# EAGLE design pico-glitcher-v1 (EAGLE 9.7.0)
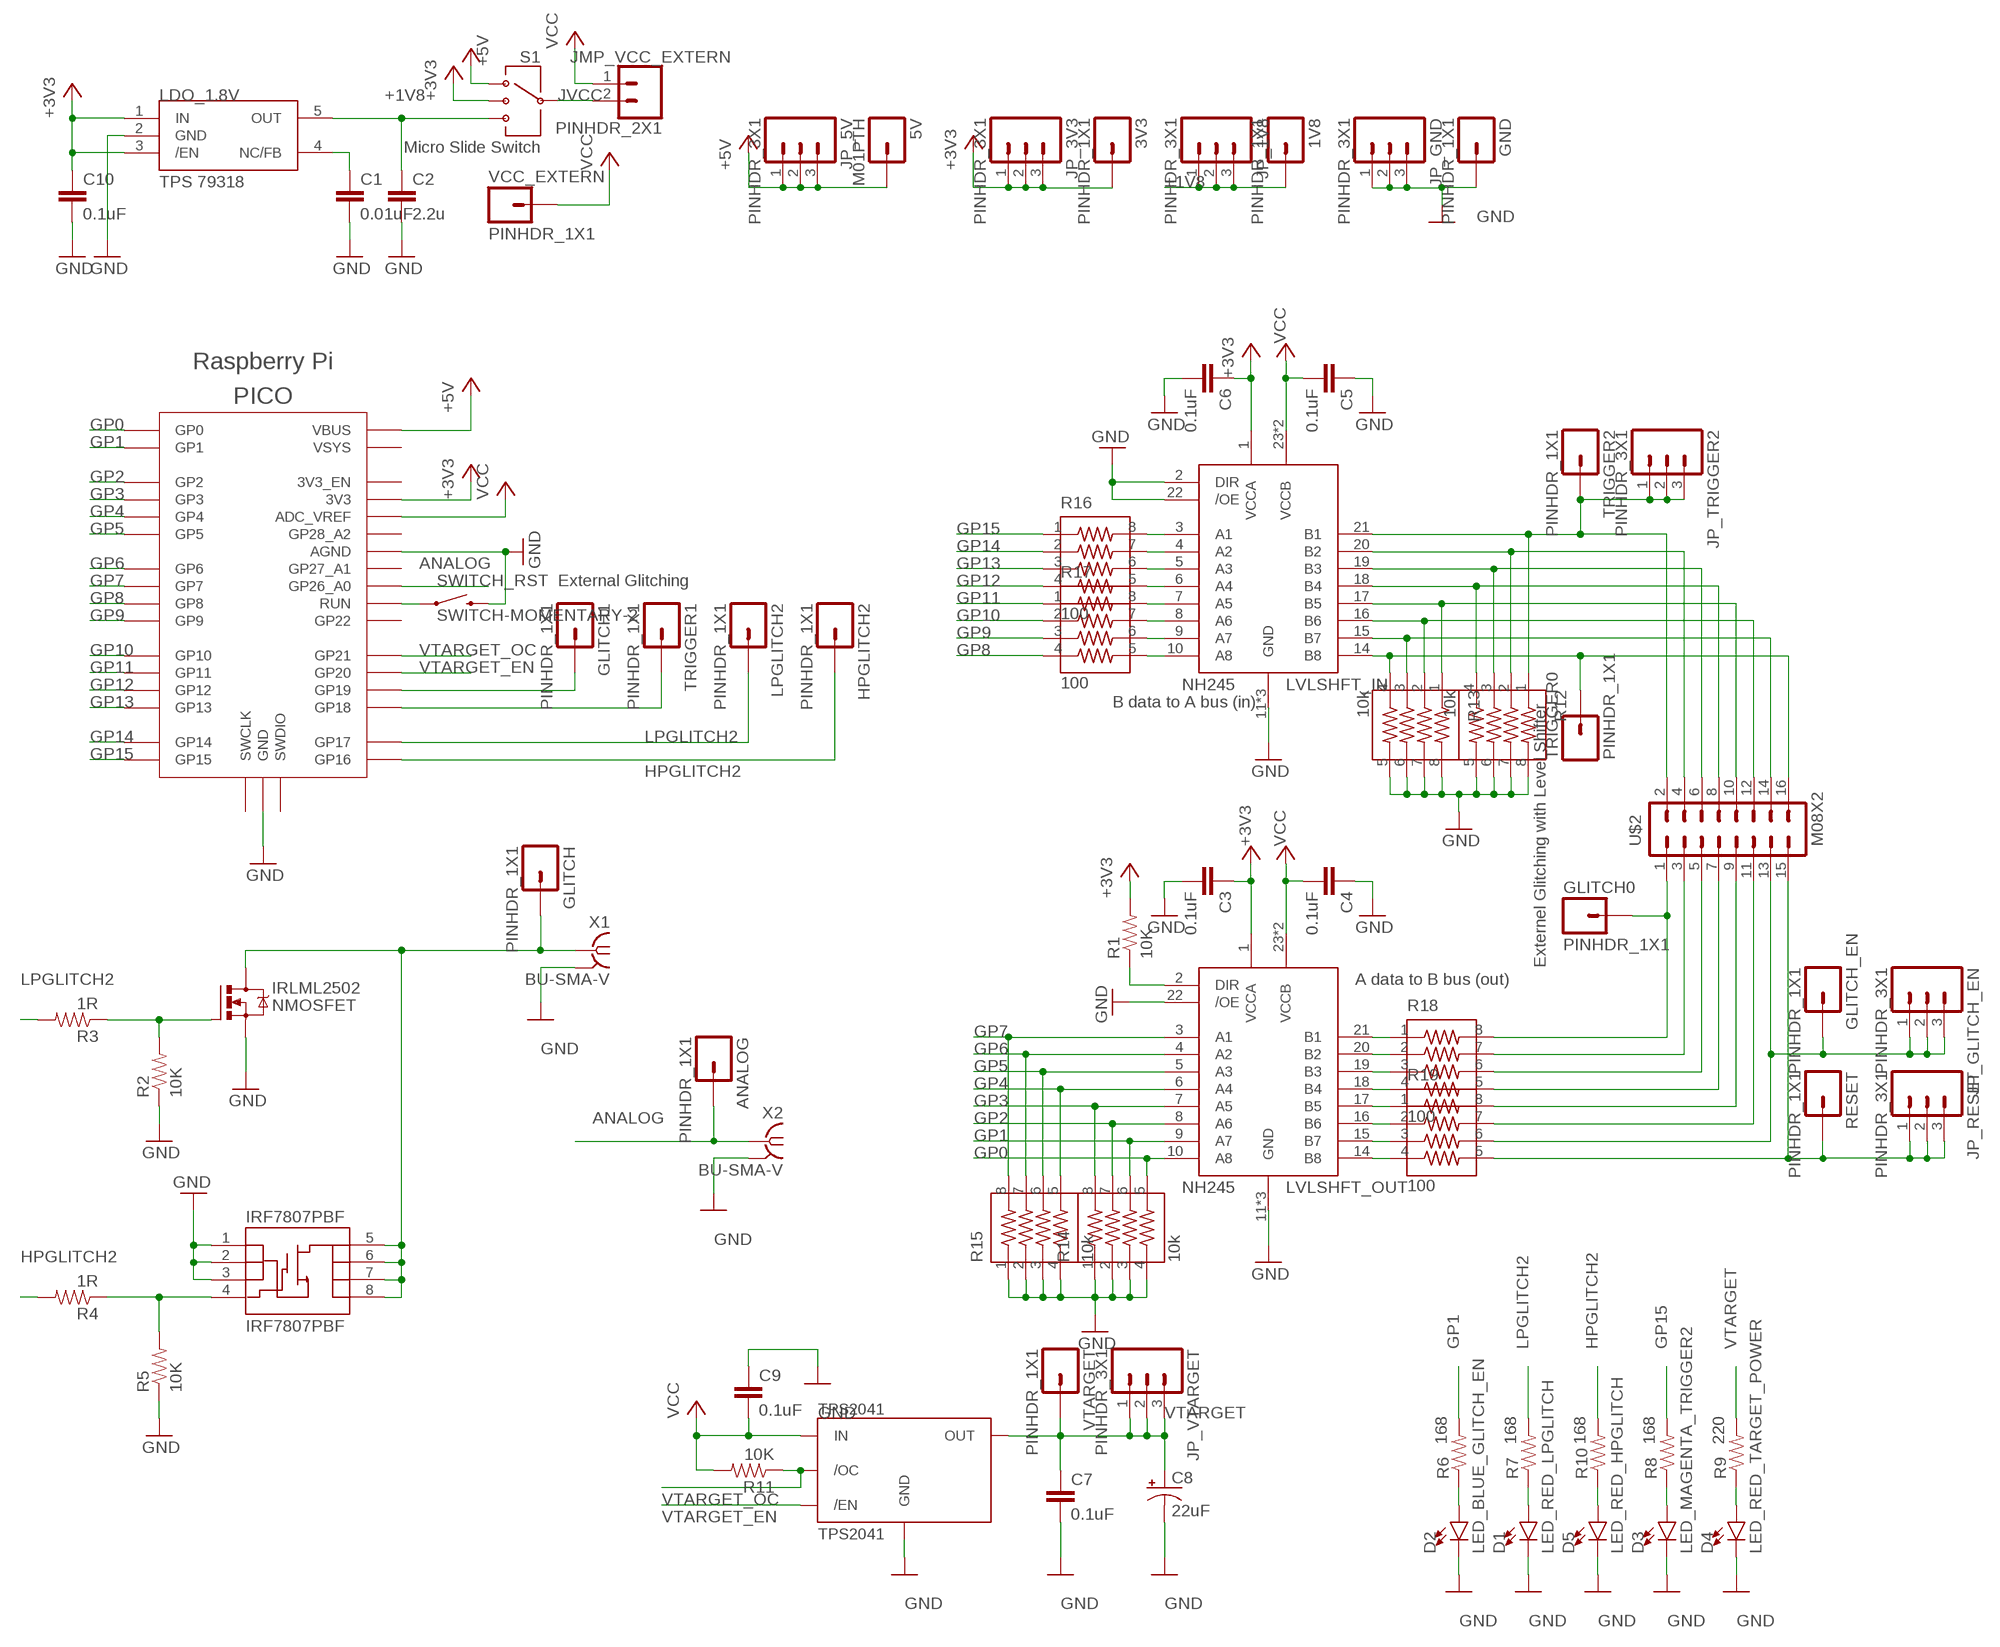
[diagram p0: schematic, sheet 1]

## Parts
1V8  PINHDR_1X1  M01PTH  [1X01]
3V3  PINHDR_1X1  M01PTH  [1X01]
5V  M01PTH  [1X01]
ANALOG  PINHDR_1X1  M01PTH  [1X01]
C1  0.01uF  0.1UF-0603-25V-10%-X7R-WE  [0603]
C2  2.2u  CAP-0805  [0805]
C3  0.1uF  0.1UF-0603-25V-10%-X7R-WE  [0603]
C4  0.1uF  0.1UF-0603-25V-10%-X7R-WE  [0603]
C5  0.1uF  0.1UF-0603-25V-10%-X7R-WE  [0603]
C6  0.1uF  0.1UF-0603-25V-10%-X7R-WE  [0603]
C7  0.1uF  0.1UF-0603-25V-10%-X7R-WE  [0603]
C8  22uF  22UF-POLAR-PANASONIC_C-35V-20%  [PANASONIC_C]
C9  0.1uF  0.1UF-0603-25V-10%-X7R-WE  [0603]
C10  0.1uF  0.1UF-0603-25V-10%-X7R-WE  [0603]
D1  LED_RED_LPGLITCH  LED0603  [LED-0603]
D2  LED_BLUE_GLITCH_EN  LED0603  [LED-0603]
D3  LED_MAGENTA_TRIGGER2  LED0603  [LED-0603]
D4  LED_RED_TARGET_POWER  LED0603  [LED-0603]
D5  LED_RED_HPGLITCH  LED0603  [LED-0603]
GLITCH  PINHDR_1X1  M01PTH  [1X01]
GLITCH0  PINHDR_1X1  M01PTH  [1X01]
GLITCH1  PINHDR_1X1  M01PTH  [1X01]
GLITCH_EN  PINHDR_1X1  M01PTH  [1X01]
GND  PINHDR_1X1  M01PTH  [1X01]
HPGLITCH2  PINHDR_1X1  M01PTH  [1X01]
IRF7807PBF  IRF7807PBF  MOSFET-NCHANNEL-SOIC8  [SO08]
IRLML2502  NMOSFET  NMOSFETSOT23-GSD  [SOT23]
JP_1V8  PINHDR_3X1  M03PTH  [1X03]
JP_3V3  PINHDR_3X1  M03PTH  [1X03]
JP_5V  PINHDR_3X1  M03PTH  [1X03]
JP_GLITCH_EN  PINHDR_3X1  M03PTH  [1X03]
JP_GND  PINHDR_3X1  M03PTH  [1X03]
JP_RESET  PINHDR_3X1  M03PTH  [1X03]
JP_TRIGGER2  PINHDR_3X1  M03PTH  [1X03]
JP_VTARGET  PINHDR_3X1  M03PTH  [1X03]
LDO_1.8V  TPS 79318  TPS769XX  [SOT23-5L]
LPGLITCH2  PINHDR_1X1  M01PTH  [1X01]
LVLSHFT_IN  NH245  NH245-SN74LVC8T245  [TSSOP24]
LVLSHFT_OUT  NH245  NH245-SN74LVC8T245  [TSSOP24]
PICO  Raspberry Pi  RPI_PICO-SMD  [RPI_PICO]
PINHDR_2X1  JMP_VCC_EXTERN  CONN_02  [1X02]
R1  10K  10KOHM1/10W1%(0603)0603  [0603-RES]
R2  10K  10KOHM1/10W1%(0603)0603  [0603-RES]
R3  1R  10KOHM1/10W1%(0603)0603  [0603-RES]
R4  1R  10KOHM1/10W1%(0603)0603  [0603-RES]
R5  10K  10KOHM1/10W1%(0603)0603  [0603-RES]
R6  168  10KOHM1/10W1%(0603)0603  [0603-RES]
R7  168  10KOHM1/10W1%(0603)0603  [0603-RES]
R8  168  10KOHM1/10W1%(0603)0603  [0603-RES]
R9  220  10KOHM1/10W1%(0603)0603  [0603-RES]
R10  168  10KOHM1/10W1%(0603)0603  [0603-RES]
R11  10K  10KOHM1/10W1%(0603)0603  [0603-RES]
R12  10k  742C083103JP  [742C083103JP]
R13  10k  742C083103JP  [742C083103JP]
R14  10k  742C083103JP  [742C083103JP]
R15  10k  742C083103JP  [742C083103JP]
R16  100  742C083103JP  [742C083103JP]
R17  100  742C083103JP  [742C083103JP]
R18  100  742C083103JP  [742C083103JP]
R19  100  742C083103JP  [742C083103JP]
RESET  PINHDR_1X1  M01PTH  [1X01]
S1  Micro Slide Switch  SWITCH-SP3T  [SWITCH-SP3T-SMD]
SWITCH_RST  SWITCH-MOMENTARY-2  [TACTILE_SWITCH_TALL]
TPS2041  TPS2041  [SO08]
TRIGGER0  PINHDR_1X1  M01PTH  [1X01]
TRIGGER1  PINHDR_1X1  M01PTH  [1X01]
TRIGGER2  PINHDR_1X1  M01PTH  [1X01]
U$2  M08X2  [2X8]
VCC_EXTERN  PINHDR_1X1  M01PTH  [1X01]
VTARGET  PINHDR_1X1  M01PTH  [1X01]
X1  BU-SMA-V  [BU-SMA-V]
X2  BU-SMA-V  [BU-SMA-V]

## Nets
+1V8: 1V8.1 C2.1 JP_1V8.1 JP_1V8.2 JP_1V8.3 LDO_1.8V.5(OUT) S1.4
+3V3: 3V3.1 C3.1 C6.1 C10.1 JP_3V3.1 JP_3V3.2 JP_3V3.3 LDO_1.8V.1(IN) LDO_1.8V.3(/EN) LVLSHFT_IN.1(VCCA) LVLSHFT_OUT.1(VCCA) PICO.3V3 R1.2 S1.2
+5V: 5V.1 JP_5V.1 JP_5V.2 JP_5V.3 PICO.VBUS S1.1
ANALOG: ANALOG.1 PICO.GP26_A0 X2.1
GLITCH: GLITCH.1 IRF7807PBF.5(D) IRF7807PBF.6(D) IRF7807PBF.7(D) IRF7807PBF.8(D) IRLML2502.3(D) X1.1
GND: C1.2 C2.2 C3.2 C4.1 C5.1 C6.2 C7.2 C8.- C9.1 C10.2 D1.C D2.C D3.C D4.C D5.C GND.1 IRF7807PBF.1(S) IRF7807PBF.2(S) IRF7807PBF.3(S) IRLML2502.2(S) JP_GND.1 JP_GND.2 JP_GND.3 LDO_1.8V.2(GND) LVLSHFT_IN.2(DIR) LVLSHFT_IN.11(GND) LVLSHFT_IN.12(GND) LVLSHFT_IN.13(GND) LVLSHFT_IN.22(/OE) LVLSHFT_OUT.11(GND) LVLSHFT_OUT.12(GND) LVLSHFT_OUT.13(GND) LVLSHFT_OUT.22(/OE) PICO.AGND PICO.GND@1(GND) PICO.GND@2(GND) PICO.GND@3(GND) PICO.GND@4(GND) PICO.GND@5(GND) PICO.GND@6(GND) PICO.GND@7(GND) PICO.GND@8(GND) R2.1 R5.1 R12.5 R12.6 R12.7 R12.8 R13.5 R13.6 R13.7 R13.8 R14.1 R14.2 R14.3 R14.4 R15.1 R15.2 R15.3 R15.4 SWITCH_RST.B2 TPS2041.1(GND) X1.2 X1.3 X1.4 X1.5 X2.2 X2.3 X2.4 X2.5
GP0: LVLSHFT_OUT.10(A8) PICO.GP0 R14.5
GP1: LVLSHFT_OUT.9(A7) PICO.GP1 R6.2 R14.6
GP2: LVLSHFT_OUT.8(A6) PICO.GP2 R14.7
GP3: LVLSHFT_OUT.7(A5) PICO.GP3 R14.8
GP4: LVLSHFT_OUT.6(A4) PICO.GP4 R15.5
GP5: LVLSHFT_OUT.5(A3) PICO.GP5 R15.6
GP6: LVLSHFT_OUT.4(A2) PICO.GP6 R15.7
GP7: LVLSHFT_OUT.3(A1) PICO.GP7 R15.8
GP8: PICO.GP8 R17.4
GP9: PICO.GP9 R17.3
GP10: PICO.GP10 R17.2
GP11: PICO.GP11 R17.1
GP12: PICO.GP12 R16.4
GP13: PICO.GP13 R16.3
GP14: PICO.GP14 R16.2
GP15: PICO.GP15 R8.2 R16.1
HPGLITCH2: HPGLITCH2.1 PICO.GP16 R4.2 R10.2
JVCC: PINHDR_2X1.2 S1.3
LPGLITCH2: LPGLITCH2.1 PICO.GP17 R3.2 R7.2
N$1: D3.A R8.1
N$2: D1.A R7.1
N$3: IRLML2502.1(G) R2.2 R3.1
N$4: D2.A R6.1
N$5: IRF7807PBF.4(G) R4.1 R5.2
N$6: D4.A R9.1
N$7: D5.A R10.1
N$8: C1.1 LDO_1.8V.4(NC/FB)
N$9: LVLSHFT_OUT.21(B1) R18.1
N$10: LVLSHFT_OUT.20(B2) R18.2
N$11: LVLSHFT_OUT.19(B3) R18.3
N$12: LVLSHFT_OUT.18(B4) R18.4
N$13: LVLSHFT_OUT.17(B5) R19.1
N$14: LVLSHFT_OUT.16(B6) R19.2
N$15: LVLSHFT_OUT.15(B7) R19.3
N$16: LVLSHFT_OUT.14(B8) R19.4
N$17: LVLSHFT_IN.3(A1) R16.8
N$18: LVLSHFT_IN.4(A2) R16.7
N$19: LVLSHFT_IN.5(A3) R16.6
N$20: LVLSHFT_IN.6(A4) R16.5
N$21: LVLSHFT_IN.7(A5) R17.8
N$22: LVLSHFT_IN.8(A6) R17.7
N$23: LVLSHFT_IN.9(A7) R17.6
N$24: LVLSHFT_IN.10(A8) R17.5
N$26: JP_TRIGGER2.1 JP_TRIGGER2.2 JP_TRIGGER2.3 LVLSHFT_IN.21(B1) R12.1 TRIGGER2.1 U$2.2
N$33: LVLSHFT_OUT.2(DIR) R1.1
N$34: PICO.RUN SWITCH_RST.A2
N$37: GLITCH1.1 PICO.GP19
N$38: JP_RESET.1 JP_RESET.2 JP_RESET.3 R19.5 RESET.1 U$2.15
N$39: GLITCH_EN.1 JP_GLITCH_EN.1 JP_GLITCH_EN.2 JP_GLITCH_EN.3 R19.6 U$2.13
N$40: R19.7 U$2.11
N$41: R19.8 U$2.9
N$42: R18.5 U$2.7
N$43: R18.6 U$2.5
N$44: R18.7 U$2.3
N$45: GLITCH0.1 R18.8 U$2.1
N$47: LVLSHFT_IN.20(B2) R12.2 U$2.4
N$48: LVLSHFT_IN.19(B3) R12.3 U$2.6
N$49: LVLSHFT_IN.18(B4) R12.4 U$2.8
N$50: LVLSHFT_IN.17(B5) R13.1 U$2.10
N$51: LVLSHFT_IN.16(B6) R13.2 U$2.12
N$52: LVLSHFT_IN.15(B7) R13.3 U$2.14
N$53: LVLSHFT_IN.14(B8) R13.4 TRIGGER0.1 U$2.16
N$54: PICO.GP18 TRIGGER1.1
VCC: C4.2 C5.2 C9.2 LVLSHFT_IN.23(VCCB) LVLSHFT_IN.24(VCCB) LVLSHFT_OUT.23(VCCB) LVLSHFT_OUT.24(VCCB) PICO.ADC_VREF PINHDR_2X1.1 R11.2 TPS2041.2(IN) TPS2041.3(IN) VCC_EXTERN.1
VTARGET: C7.1 C8.+ JP_VTARGET.1 JP_VTARGET.2 JP_VTARGET.3 R9.2 TPS2041.6(OUT) TPS2041.7(OUT) TPS2041.8(OUT) VTARGET.1
VTARGET_EN: PICO.GP20 TPS2041.4(/EN)
VTARGET_OC: PICO.GP21 R11.1 TPS2041.5(/OC)
Unconnected: PICO.3V3_EN PICO.GP22 PICO.GP27_A1 PICO.GP28_A2 PICO.SWCLK PICO.SWDIO PICO.VSYS

## Notes on the sheet
- External Glitching
- B data to A bus (in)
- Externel Glitching with Level Shifter
- A data to B bus (out)

## Library data of the parts
1V8 3V3 5V ANALOG GLITCH GLITCH0 GLITCH1 GLITCH_EN GND HPGLITCH2 LPGLITCH2 RESET TRIGGER0 TRIGGER1 TRIGGER2 VCC_EXTERN VTARGET = SparkFun-Connectors:M01: Header 1 Standard 1-pin 0.1" header. Use with straight break away headers (SKU : PRT-00116), right angle break away headers (PRT-00553), swiss pins (PRT-00743), machine pins (PRT-00117), and female headers (PRT-00115).
C1 = SparkFun-Capacitors:0.1UF: 0.1µF ceramic capacitors A capacitor is a passive two-terminal electrical component used to store electrical energy temporarily in an electric field.; PROD_ID: CAP-16503; VALUE: 0.1uF
C2 = SparkFun-Capacitors:CAP
C3-C7 C9 C10 = SparkFun-Capacitors:0.1UF: 0.1µF ceramic capacitors A capacitor is a passive two-terminal electrical component used to store electrical energy temporarily in an electric field.; PROD_ID: CAP-16503
C8 = SparkFun-Capacitors:22UF-POLAR: 22µF polarized capacitors A capacitor is a passive two-terminal electrical component used to store electrical energy temporarily in an electric field.; PROD_ID: CAP-08618
D1-D5 = SparkFun-LED:LED: LED (Generic) Standard schematic elements and footprints for 5mm, 3mm, 1206, and 0603 sized LEDs. Generic LEDs with no color specified.
IRF7807PBF = SparkFun:MOSFET-NCHANNEL-SOIC8: N-Channel MOSFET IRF9410 and NDS8434 are common, SOIC-8 parts.
IRLML2502 = Transistor:NMOSFET: N-Channel MOSFET - Generic; CATEGORY: Transistor; SUB-CATEGORY: MOSFET; TYPE: N-Channel
JP_1V8 JP_3V3 JP_5V JP_GLITCH_EN JP_GND JP_RESET JP_TRIGGER2 JP_VTARGET = SparkFun-Connectors:M03: Header 3 Standard 3-pin 0.1" header. Use with straight break away headers (SKU : PRT-00116), right angle break away headers (PRT-00553), swiss pins (PRT-00743), machine pins (PRT-00117), and female headers (PRT-00115). Molex polarized connector foot print use with SKU : PRT-08232 with associated crimp pins and housings.
LDO_1.8V = tps769xx:TPS769XX
LVLSHFT_IN LVLSHFT_OUT = TI_NH245_SN74LVC8T245:NH245-SN74LVC8T245
PICO = RaspberryPi_Pico:RPI_PICO
PINHDR_2X1 = SparkFun-Connectors:CONN_02: Multi connection point. Often used as Generic Header-pin footprint for 0.1 inch spaced/style header connections On any of the 0.1 inch spaced packages, you can populate with these: Break Away Headers - Straight <https://www.sparkfun.com/products/116> (PRT-00116) Break Away Male Headers - Right Angle <https://www.sparkfun.com/products/553> (PRT-00553) Female Headers <https://www.sparkfun.com/products/115> (PRT-00115) Break Away Headers - Machine Pin <https://www.sparkfun.com/products/117> (PRT-00117) Break Away Female Headers - Swiss Machine Pin <https://www.sparkfun.com/products/743> (PRT-00743) For SCREWTERMINALS and SPRING TERMINALS visit here: Screw Terimnals on SparkFun.com <https://www.sparkfun.com/search/results?term=Screw+Terminals> (5mm/3.5mm/2.54mm spacing) This device is also useful as a general connection point to wire up your design to another part of your project. Our various solder wires solder well into these plated through hole pads. Hook-Up Wire - Assortment (Stranded, 22 AWG) <https://www.sparkfun.com/products/11375> (PRT-11375) Hook-Up Wire - Assortment (Solid Core, 22 AWG) <https://www.sparkfun.com/products/11367> (PRT-11367) View the entire wire category on our website here <https://www.sparkfun.com/categories/141> Special notes: Molex polarized connector foot print use with: PRT-08233 with associated crimp pins and housings. 2.54_SCREWTERM for use with PRT-10571. 3.5mm Screw Terminal footprints for PRT-08084 5mm Screw Terminal footprints for use with PRT-08432
R1 R2 R5 R11 = SparkFun-Resistors:10KOHM1/10W1%(0603): RES-00824; PROD_ID: RES-00824
R3 R4 R6-R10 = SparkFun-Resistors:10KOHM1/10W1%(0603): RES-00824; PROD_ID: RES-00824; VALUE: 10K
R12-R19 = Resistor Array:742C083103JP: RES ARRAY 4 RES 10K OHM 1206 Manufacturer's datasheet <https://www.ctscorp.com/wp-content/uploads/74x.pdf>; CREATED_BY: PCBLayout.com; DIGIKEY_PN: 742C083103JPTR-ND; MANUFACTURER: CTS Resistor Products; MPN: 742C083103JP; PACKAGE: 1206
S1 = SparkFun:SWITCH-SP3T
SWITCH_RST = SparkFun:SWITCH-MOMENTARY-2
TPS2041 = TPS2041:TPS2041
U$2 = SparkFun-Connectors:M08X2: .1" headers, two rows of 8 each
X1 X2 = con-coax:BU-SMA-V: FEMALE SMA CONNECTOR Radiall distributor RS 112-3794; OC_FARNELL: unknown; OC_NEWARK: unknown

## Board
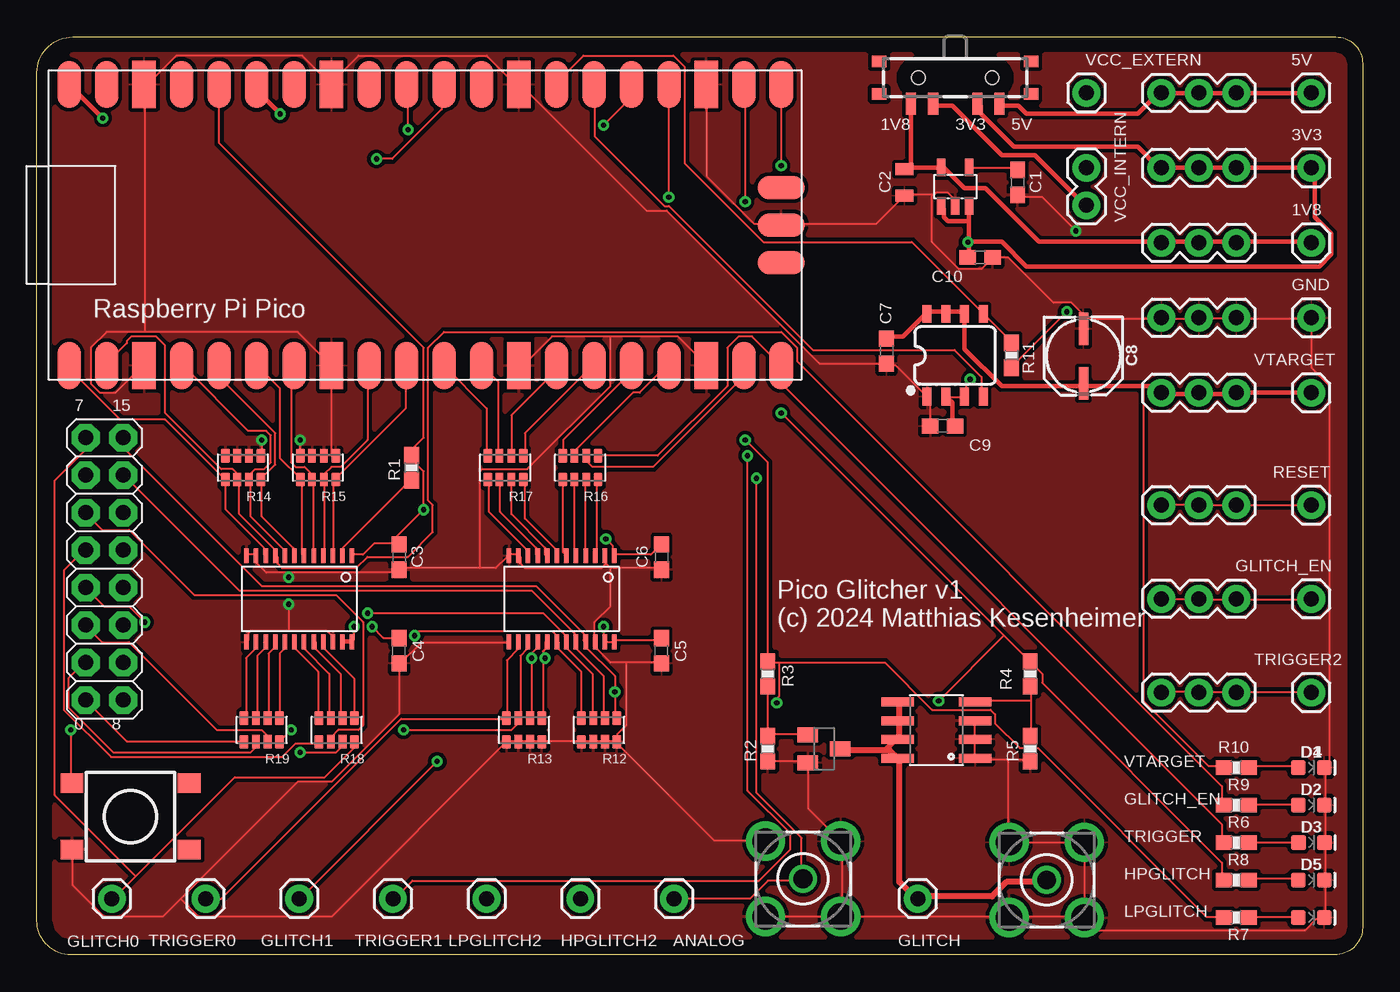
[diagram p1: board, top side]
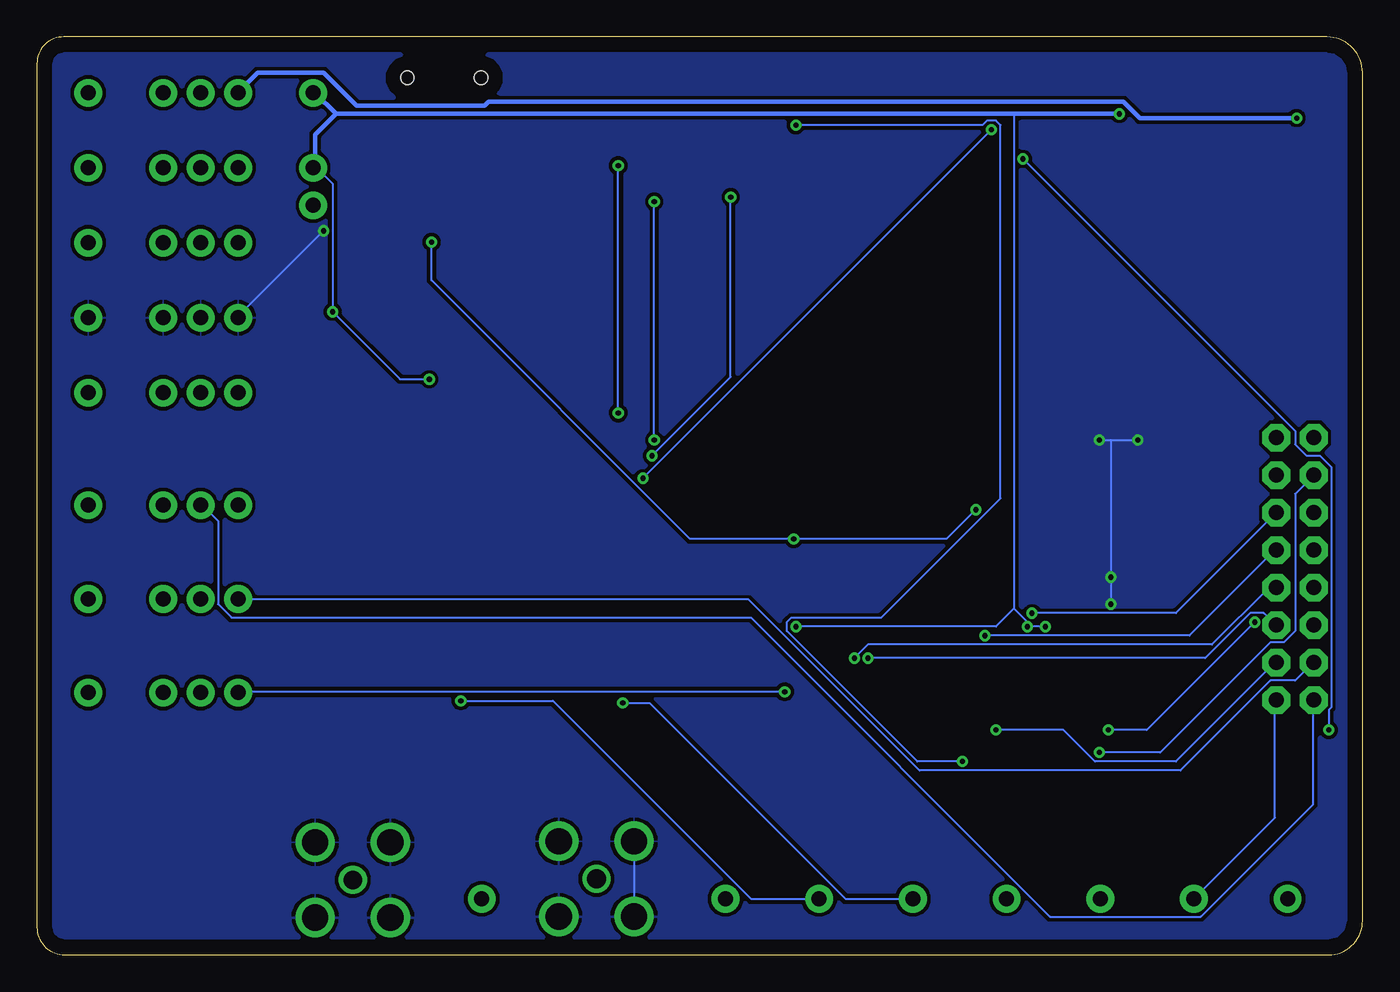
[diagram p2: board, bottom side, seen from below]

Size 89.84 x 62.22 mm. Coordinates in mm from the lower left corner, seen from the top.
Outline: 0,59.79 arc-90 2.43,62.22 88.04,62.22 arc-90 89.84,60.42 89.84,1.89 arc-90 87.95,0 2.32,0 arc-90 0,2.32 0,59.79
Copper layers (1*16): Top / Bottom
Stack-up Default Layer Stack: Top User Defined 0.035mm / Dielectric-1 User Defined 1.5mm / Bottom User Defined 0.035mm
Design rules: minimum drill size 0.35mm, minimum copper width 6mil, keepout clearance 0mil, drill distance 6mil, via restrict clearance 0mil, dimension clearance 40mil, restrict clearance 0mil, copper clearance wire_polygon to wire_polygon 6mil, copper clearance wire_polygon to pad_smd 6mil, copper clearance wire_polygon to via 6mil, copper clearance pad_smd to pad_smd 6mil, copper clearance pad_smd to via 6mil, copper clearance via to via 6mil, copper clearance smd to pad (same net) 6mil, copper clearance smd to via (same net) 6mil, copper clearance smd to smd (same net) 6mil

### Footprints (pad centres in the part's own frame; a part is rotated, then mirrored left to right if it is on the bottom)
1X01 = drill 1.016 pad 1.88: 1 0,0
0603 = smd 1.1 x 1: 1 -0.85,0; 2 0.85,0
0805 = smd 0.8 x 1.2: 1 -0.9,0; 2 0.9,0
PANASONIC_C = smd 2.2 x 0.65: + 1.9,-0.2; - -1.8,-0.2
LED-0603 = smd 1 x 1: A -0.877,0; C 0.877,0
SO08 = smd 0.61 x 2.21: 1 -1.905,-2.616; 2 -0.635,-2.616; 3 0.635,-2.616; 4 1.905,-2.616; 5 1.905,2.616; 6 0.635,2.616; 7 -0.635,2.616; 8 -1.905,2.616
SOT23 = smd 1 x 1.4: 1 -0.95,-1.1; 2 0.95,-1.1; 3 0,1.1
1X03 = drill 1.016 pad 1.88: 1 0,0; 2 2.54,0; 3 5.08,0
SOT23-5L = smd 0.55 x 1.2: 1 -0.95,-1.3; 2 0,-1.3; 3 0.95,-1.3; 4 0.95,1.3; 5 -0.95,1.3
TSSOP24 = smd 0.305 x 0.991: 1 -3.575,-2.918; 2 -2.925,-2.918; 3 -2.275,-2.918; 4 -1.625,-2.918; 5 -0.975,-2.918; 6 -0.325,-2.918; 7 0.325,-2.918; 8 0.975,-2.918; 9 1.625,-2.918; 10 2.275,-2.918; 11 2.925,-2.918; 12 3.575,-2.918; 13 3.575,2.918; 14 2.925,2.918; 15 2.275,2.918; 16 1.625,2.918; 17 0.975,2.918; 18 0.325,2.918; 19 -0.325,2.918; 20 -0.975,2.918; 21 -1.625,2.918; 22 -2.275,2.918; 23 -2.925,2.918; 24 -3.575,2.918
RPI_PICO = smd 3.2 x 1.6: 3V3 9.525,13.97; 3V3_EN 9.525,16.51; ADC_VREF 9.525,11.43; AGND 9.525,6.35; GND@1 -9.525,19.05; GND@2 -9.525,6.35; GND@3 -9.525,-6.35; GND@4 -9.525,-19.05; GND@6 9.525,-19.05; GND@7 9.525,-6.35; GND@8 9.525,19.05; GP0 -9.525,24.13; GP1 -9.525,21.59; GP2 -9.525,16.51; GP3 -9.525,13.97; GP4 -9.525,11.43; GP5 -9.525,8.89; GP6 -9.525,3.81; GP7 -9.525,1.27; GP8 -9.525,-1.27; GP9 -9.525,-3.81; GP10 -9.525,-8.89; GP11 -9.525,-11.43; GP12 -9.525,-13.97; GP13 -9.525,-16.51; GP14 -9.525,-21.59; GP15 -9.525,-24.13; GP16 9.525,-24.13; GP17 9.525,-21.59; GP18 9.525,-16.51; GP19 9.525,-13.97; GP20 9.525,-11.43; GP21 9.525,-8.89; GP22 9.525,-3.81; GP26_A0 9.525,1.27; GP27_A1 9.525,3.81; GP28_A2 9.525,8.89; RUN 9.525,-1.27; VBUS 9.525,24.13; VSYS 9.525,21.59 | smd 1.6 x 3.2: GND@5 0,-24.13; SWCLK -2.54,-24.13; SWDIO 2.54,-24.13
1X02 = drill 1.016 pad 1.88: 1 0,0; 2 2.54,0
0603-RES = smd 1.1 x 1: 1 -0.85,0; 2 0.85,0
742C083103JP = smd 0.59 x 0.92: 1 -1.2,-0.8; 2 -0.4,-0.8; 3 0.4,-0.8; 4 1.2,-0.8; 5 1.2,0.8; 6 0.4,0.8; 7 -0.4,0.8; 8 -1.2,0.8
SWITCH-SP3T-SMD = smd 0.7 x 1.5: 1 3,-1.75; 2 1.5,-1.75; 3 -1.5,-1.75; 4 -3,-1.75 | smd 1 x 0.8: P$1 -5.15,-1.1; P$2 -5.15,1.1; P$3 5.15,1.1; P$4 5.15,-1.1 | hole 0.9: 2.5,0; -2.5,0
TACTILE_SWITCH_TALL = smd 1.55 x 1.3: A1 -3.975,-2.25; A2 3.975,-2.25; B1 -3.975,2.25; B2 3.975,2.25
SO08' = smd 0.6 x 1.2: 1 -1.905,-2.8; 2 -0.635,-2.8; 3 0.635,-2.8; 4 1.905,-2.8; 5 1.905,2.8; 6 0.635,2.8; 7 -0.635,2.8; 8 -1.905,2.8
2X8 = drill 1.016 pad 1.88 octagon: 1 0,0; 2 0,2.54; 3 2.54,0; 4 2.54,2.54; 5 5.08,0; 6 5.08,2.54; 7 7.62,0; 8 7.62,2.54; 9 10.16,0; 10 10.16,2.54; 11 12.7,0; 12 12.7,2.54; 13 15.24,0; 14 15.24,2.54; 15 17.78,0; 16 17.78,2.54
BU-SMA-V = drill 1.27: 1 0,0 | drill 1.778: 2 -2.55,2.55; 3 2.55,2.55; 4 2.55,-2.55; 5 -2.55,-2.55

### Placement (x,y rotation side)
1V8  86.36,48.26 0 top
3V3  86.36,53.34 0 top
5V  86.36,58.42 0 top
ANALOG  43.18,3.81 0 top
C1  66.46,52.36 270 top
C2  58.79,52.36 270 top
C3  24.55,26.96 270 top
C4  24.55,20.61 90 top
C5  42.33,20.61 90 top
C6  42.33,26.96 270 top
C7  57.57,40.93 270 top
C8  71.12,40.64 270 top
C9  61.38,35.85 0 top
C10  63.92,47.28 0 top
D1  86.36,2.54 0 top
D2  86.36,10.16 0 top
D3  86.37,7.62 0 top
D4  86.36,12.7 0 top
D5  86.36,5.08 0 top
GLITCH  59.69,3.81 0 top
GLITCH0  5.08,3.81 0 top
GLITCH1  17.78,3.81 0 top
GLITCH_EN  86.36,24.13 0 top
GND  86.36,43.18 0 top
HPGLITCH2  36.83,3.81 0 top
IRF7807PBF  60.96,15.24 90 top
IRLML2502  53.34,13.97 270 top
JP_1V8  76.2,48.26 0 top
JP_3V3  76.2,53.34 0 top
JP_5V  76.2,58.42 0 top
JP_GLITCH_EN  76.2,24.13 0 top
JP_GND  76.2,43.18 0 top
JP_RESET  76.2,30.48 0 top
JP_TRIGGER2  76.2,17.78 0 top
JP_VTARGET  76.2,38.1 0 top
LDO_1.8V  62.23,52.07 0 top
LPGLITCH2  30.48,3.81 0 top
LVLSHFT_IN  35.56,24.13 180 top
LVLSHFT_OUT  17.78,24.13 180 top
PICO  26.31,49.47 90 top
PINHDR_2X1  71.12,53.34 270 top
R1  25.4,33.02 90 top
R2  49.53,13.97 90 top
R3  49.53,19.05 90 top
R4  67.31,19.05 90 top
R5  67.31,13.97 90 top
R6  81.28,10.16 180 top
R7  81.28,2.54 180 top
R8  81.28,7.62 180 top
R9  81.28,12.7 180 top
R10  81.28,5.08 180 top
R11  66.04,40.64 270 top
R12  38.1,15.24 180 top
R13  33.02,15.24 180 top
R14  13.97,33.02 180 top
R15  19.05,33.02 180 top
R16  36.83,33.02 180 top
R17  31.75,33.02 180 top
R18  20.32,15.24 180 top
R19  15.24,15.24 180 top
RESET  86.36,30.48 0 top
S1  62.23,59.45 0 top
SWITCH_RST  6.35,9.39 180 top
TPS2041  TPS2041  [SO08']  62.23,40.64 0 top
TRIGGER0  11.43,3.81 0 top
TRIGGER1  24.13,3.81 0 top
TRIGGER2  86.36,17.78 0 top
U$2  3.3,35.05 270 top
VCC_EXTERN  71.12,58.42 0 top
VTARGET  86.36,38.1 0 top
X1  68.43,5.08 0 top
X2  51.92,5.15 0 top

### Tracks (layer width: path | path; a pad name or v marks a point on that pad's centre or on a via)
+1V8
  Top 0.305: 1V8.1 86.33,48.34 81.31,48.34 JP_1V8.3 81.03,48.34 78.79,48.34 JP_1V8.2 78.51,48.34 76.28,48.34 JP_1V8.1 76,48.34 67.89,48.34 64.26,51.97 62.87,51.97 61.47,53.37 LDO_1.8V.5 61.19,53.37 59.23,53.37 | 59.23,53.37 58.95,53.37 C2.1 59.23,53.37 | 59.23,53.37 59.23,57.56 S1.4
+3V3  (via drill 0.35)
  Top 0.152: C6.1 42.22,27.74 41.6,27.13 39.17,27.13 LVLSHFT_IN.1 39.01,27.13 39.01,27.74 v38.56,28.19 | LVLSHFT_OUT.1 21.49,27.13 22.1,27.13 22.86,27.89 24.23,27.89 C3.1 24.38,28.35 v26.21,30.18 26.21,32.77 25.45,33.53 25.45,33.83 R1.2 25.3,34.14 26.21,35.05 26.21,41.15 12.34,55.02 12.34,58.98 PICO.3V3 | v63.09,48.31 63.14,48.31
  Top 0.305: S1.2 63.98,57.56 63.98,57 66.22,54.76 74.6,54.76 76,53.37 JP_3V3.1 76.28,53.37 78.51,53.37 JP_3V3.2 78.79,53.37 81.03,53.37 JP_3V3.3 81.31,53.37 86.33,53.37 3V3.1 86.61,53.09 86.61,50.01 87.73,48.9 87.73,47.5 86.89,46.66 67.06,46.66 65.38,48.34 63.14,48.34 | 63.14,49.73 63.14,50.57 LDO_1.8V.3 | 63.14,49.73 63.14,48.34 | 63.14,48.34 63.14,48.31 63.14,47.5 C10.1 | 63.14,49.73 61.75,49.73 61.47,50.01 61.47,50.57 LDO_1.8V.1 | 24.31,27.94 C3.1
  Bottom 0.152: v26.21,30.18 28.19,28.19 v38.56,28.19 45.57,28.19 63.09,45.72 v63.09,48.31
+5V  (via drill 0.35)
  Top 0.305: 5V.1 86.33,58.4 81.31,58.4 JP_5V.3 81.03,58.4 78.79,58.4 JP_5V.2 78.51,58.4 76.28,58.4 JP_5V.1 76,58.4 74.6,57 67.06,57 66.5,57.56 65.38,57.56 S1.1 | v4.47,56.72 2.23,58.95 PICO.VBUS
  Bottom 0.305: v4.47,56.72 15.09,56.72 16.2,57.84 59.23,57.84 59.51,57.56 68.17,57.56 70.41,59.79 74.88,59.79 76,58.67 JP_5V.1
ANALOG  (via drill 0.35)
  Top 0.152: v25.15,55.93 25.15,58.98 PICO.GP26_A0 | v48.77,32.31 48.77,10.97 51.82,7.92 51.82,5.18 X2.1 51.82,5.03 49.53,5.03 48.31,3.81 ANALOG.1
  Bottom 0.152: v48.77,32.31 v25.15,55.93
GLITCH
  Top 0.406: 57.45,13.87 57.78,13.87 58.12,13.54 IRF7807PBF.8 58.45,13.21 58.45,4.95 59.44,3.96 GLITCH.1 59.77,3.96 64.72,3.96 65.71,4.95 68.35,4.95 X1.1 | 57.45,13.87 54.48,13.87 IRLML2502.3 | 57.45,13.87 58.12,14.53 IRF7807PBF.7 58.45,14.86 58.45,15.85 | 58.45,15.85 58.45,17.17 IRF7807PBF.5 | 58.45,15.85 IRF7807PBF.6
GND  (via drill 0.35)
  Top 0.152: 7.32,42.22 17.68,42.22 19.81,40.08 PICO.GND@2 19.96,39.93 19.96,33.83 | 7.32,42.22 4.72,42.22 3.66,41.15 3.66,38.71 4.27,38.1 5.33,38.1 7.16,39.93 PICO.GND@1 | 17.07,21.95 19.66,21.95 19.96,21.64 19.96,21.34 LVLSHFT_OUT.22 | 17.07,21.95 14.48,21.95 14.33,21.79 14.33,21.34 LVLSHFT_OUT.13 | R14.4 12.8,33.83 13.56,33.83 R14.3 13.72,33.83 14.33,33.83 R14.2 14.48,33.83 15.09,33.83 R14.1 15.24,33.83 v15.24,34.9 | 19.96,33.83 20.12,33.83 R15.1 19.96,33.83 | 19.96,33.83 19.51,33.83 R15.2 19.36,33.83 18.75,33.83 R15.3 18.59,33.83 17.98,33.83 R15.4 17.83,33.83 v17.83,34.9 | v17.07,23.77 17.07,21.95 | C9.1 60.5,35.97 60.5,37.64 60.35,37.8 TPS2041.1 60.2,37.95 58.22,39.93 57.61,39.93 C7.2 57.45,40.08 53.03,40.08 42.67,50.44 41.3,50.44 32.77,58.98 PICO.GND@7 32.61,59.13 32.31,59.13 30.48,60.96 21.79,60.96 19.96,59.13 PICO.AGND 19.81,59.13 17.98,60.96 9.45,60.96 7.62,59.13 7.32,59.13 PICO.GND@8 7.32,58.98 7.32,42.22 | v70.41,49.07 68.12,51.36 66.6,51.36 C1.2 | 76.2,43.13 78.64,43.13 JP_GND.2 78.79,43.13 81.23,43.13 JP_GND.3 81.38,43.13 86.26,43.13 GND.1 86.41,43.13 86.41,39.78 87.63,38.56 87.63,13.11 87.33,12.8 D4.C 87.33,12.65 87.33,10.21 D2.C 87.33,10.06 87.33,7.62 | 60.66,51.51 60.81,51.51 60.96,51.66 61.72,51.66 62.18,51.21 62.18,50.9 LDO_1.8V.2 | 60.66,51.51 58.83,51.51 C2.2 58.67,51.36 56.84,49.53 50.44,49.53 PICO.GND@5 50.29,49.53 48.62,49.53 45.41,52.73 45.41,58.98 PICO.GND@6 | 64.77,47.24 65.84,47.24 68.89,44.2 70.1,44.2 70.87,43.43 70.87,43.13 | 70.87,43.13 70.87,42.52 C8.- 70.87,43.13 | 60.66,51.51 60.66,48.31 62.48,46.48 64.01,46.48 64.77,47.24
  Top 0.152: 64.77,47.24 C10.2 | 70.87,43.13 76.2,43.13 | 76.2,43.13 JP_GND.1 | R2.1 49.53,13.11 52.12,13.11 IRLML2502.2 52.27,12.95 52.27,9.91 54.41,7.77 X2.3 54.56,7.62 54.56,2.74 X2.4 | X2.5 54.41,2.59 X2.4 | 65.84,13.26 63.7,13.26 IRF7807PBF.1 63.55,13.41 63.55,14.48 IRF7807PBF.2 63.55,14.63 63.55,15.85 IRF7807PBF.3 | 65.84,13.26 67.21,13.26 R5.1 | 65.84,13.26 65.84,7.77 X1.2 65.99,7.62 70.87,7.62 X1.3 71.02,7.62 71.02,2.59 X1.4 | 87.33,7.62 87.33,5.18 D5.C 87.33,5.03 87.33,2.59 D1.C 87.17,2.44 86.72,2.44 85.95,1.68 71.78,1.68 71.02,2.44 X1.4 | 87.33,7.62 D3.C | X1.4 70.87,2.59 65.99,2.59 X1.5 65.84,2.59 54.56,2.59 X2.4 | LVLSHFT_IN.13 31.85,21.18 26.06,21.18 24.69,19.81 C4.1 24.54,19.66 24.54,16.31 19.96,11.73 17.68,11.73 9.75,3.81 | 9.75,3.81 8.53,2.59 4.57,2.59 2.44,4.72 2.44,7.01 SWITCH_RST.B2 | R12.8 39.17,14.48 38.56,14.48 R12.7 38.41,14.48 37.8,14.48 R12.6 37.64,14.48 37.03,14.48 R12.5 36.88,14.48 34.29,14.48 R13.8 34.14,14.48 33.53,14.48 R13.7 33.38,14.48 32.77,14.48 R13.6 32.61,14.48 31.85,14.48 R13.5 31.7,14.33 19.96,2.59 10.97,2.59 9.75,3.81 | 38.56,26.52 38.56,26.98 LVLSHFT_IN.2 | 38.86,26.21 38.56,26.52 | 38.86,26.21 42.22,26.21 C6.2 | 39.93,19.81 42.22,19.81 C5.1 | 39.93,19.81 38.86,19.81 37.95,20.73 37.95,21.18 LVLSHFT_IN.22 37.8,21.34 37.8,22.55 38.86,23.62 38.86,26.21 | 39.93,19.81 39.93,15.54 39.32,14.94 39.32,14.48 R12.8 | 38.86,41.91 43.43,41.91 45.26,40.08 PICO.GND@4 | 38.86,41.91 34.9,41.91 33.07,40.08 32.77,40.08 PICO.GND@3 | LVLSHFT_OUT.12 14.33,27.13 14.78,27.13 LVLSHFT_OUT.11 14.94,26.98 14.94,26.52 15.54,25.91 17.07,25.91 | 30.02,26.21 31.09,26.21 31.85,26.98 LVLSHFT_IN.12 32,27.13 32.61,27.13 LVLSHFT_IN.11 32.77,26.98 32.77,26.52 33.07,26.21 38.25,26.21 38.56,26.52
  Top 0.152: 30.02,26.21 24.69,26.21 C3.2 24.54,26.06 24.38,25.91 17.07,25.91 | 38.86,41.91 38.86,38.56 33.22,32.92 30.18,32.92 30.02,32.77 30.02,26.21 | X2.2 49.23,7.77 45.87,7.77 39.32,14.33 R12.8 | 17.07,25.91 v17.07,25.6
  Bottom 0.152: v17.83,34.9 17.07,34.9 | 17.07,34.9 v15.24,34.9 | 17.07,34.9 v17.07,25.6 v17.07,23.77 | v70.41,49.07 76.2,43.28 JP_GND.1 | X2.5 49.38,2.74 49.38,7.62 X2.2
  pour Top (isolate 0.254): 0,0 89.92,0 90.17,0.25 90.17,62.23 0.25,62.23 0,61.98
  pour Bottom (isolate 0.254): 0,0 89.92,0 90.17,0.25 90.17,62.23 0.25,62.23 0,61.98
GP0
  Top 0.152: LVLSHFT_OUT.10 15.39,27.13 15.39,27.58 12.8,30.18 12.8,32.16 R14.5 12.65,32.31 8.69,36.27 5.64,36.27 2.29,39.62 2.29,39.93 PICO.GP0
GP1
  Top 0.152: R6.2 80.31,10.21 80.31,11.43 51.51,40.23 51.51,41.15 50.44,42.22 27.58,42.22 26.52,41.15 26.52,30.79 26.82,30.48 26.82,28.65 25.15,26.98 22.4,26.98 21.64,26.21 16.61,26.21 16.31,26.52 16.31,26.98 LVLSHFT_OUT.9 16.15,27.13 16.15,27.43 13.72,29.87 13.72,32.16 R14.6 13.56,32.31 13.56,32.61 13.26,32.92 12.5,32.92 8.69,36.73 8.69,41.3 8.08,41.91 6.4,41.91 6.1,41.6 6.1,41.45 4.72,40.08 PICO.GP1
GP2
  Top 0.152: LVLSHFT_OUT.8 16.76,27.13 16.76,27.43 14.48,29.72 14.48,32.16 R14.7 14.48,32.31 14.48,32.61 14.78,32.92 15.39,32.92 15.85,33.38 15.85,35.2 15.54,35.51 14.33,35.51 9.91,39.93 PICO.GP2
GP3
  Top 0.152: LVLSHFT_OUT.7 17.37,27.13 17.37,27.58 15.24,29.72 15.24,32.16 R14.8 15.24,32.31 16.15,33.22 16.15,35.36 12.34,39.17 12.34,39.93 PICO.GP3
GP4
  Top 0.152: LVLSHFT_OUT.6 17.98,27.13 17.98,32.16 R15.5 17.83,32.31 16.46,33.68 16.46,38.41 14.94,39.93 PICO.GP4
GP5
  Top 0.152: LVLSHFT_OUT.5 18.75,27.13 18.75,32.16 R15.6 18.59,32.31 18.59,32.61 18.14,33.07 17.53,33.07 17.22,33.38 17.22,39.78 17.37,39.93 PICO.GP5
GP6
  Top 0.152: LVLSHFT_OUT.4 19.51,27.13 19.51,32.16 R15.7 19.51,32.31 19.51,32.61 19.96,33.07 20.57,33.07 22.4,34.9 22.4,39.93 PICO.GP6
GP7
  Top 0.152: LVLSHFT_OUT.3 20.12,27.13 20.12,32.16 R15.8 20.27,32.31 24.99,37.03 24.99,39.93 PICO.GP7
GP8
  Top 0.152: R17.4 30.48,33.83 30.48,37.03 27.58,39.93 PICO.GP8
GP9
  Top 0.152: R17.3 31.24,33.83 31.24,38.86 30.18,39.93 PICO.GP9
GP10
  Top 0.152: R17.2 32.16,33.83 32.16,36.58 35.05,39.47 35.05,39.93 PICO.GP10
GP11
  Top 0.152: R17.1 33.07,33.83 33.07,35.36 37.64,39.93 PICO.GP11
GP12
  Top 0.152: R16.4 35.66,33.83 35.66,34.9 40.23,39.47 40.23,39.93 PICO.GP12
GP13
  Top 0.152: R16.3 36.58,33.83 36.58,34.29 40.39,38.1 40.84,38.1 42.67,39.93 PICO.GP13
GP14
  Top 0.152: R16.2 37.34,33.68 37.34,33.38 37.64,33.07 41.76,33.07 47.85,39.17 47.85,39.93 PICO.GP14
GP15
  Top 0.152: R16.1 38.1,33.83 42.06,33.83 46.79,38.56 46.79,41.15 47.55,41.91 48.46,41.91 50.29,40.08 PICO.GP15 50.44,39.93 50.44,38.71 80.31,8.84 80.31,7.62 R8.2
HPGLITCH2  (via drill 0.35)
  Top 0.152: R10.2 80.31,5.18 80.31,6.25 68.12,18.44 68.12,19.05 67.36,19.81 R4.2 67.21,19.96 65.53,21.64 | v50.44,53.49 50.44,58.98 PICO.GP16 | 65.53,21.64 v50.44,36.73 | 65.53,21.64 v61.11,17.22
  Bottom 0.152: v50.44,36.73 v50.44,53.49 | HPGLITCH2.1 41.45,3.81 54.86,17.22 v61.11,17.22
JVCC
  Top 0.305: S1.3 60.91,57.56 62.03,57.56 65.38,54.2 67.61,54.2 70.97,50.85 PINHDR_2X1.2
LPGLITCH2  (via drill 0.35)
  Top 0.152: 50.29,19.81 49.53,19.81 R3.2 49.53,33.38 v48.01,34.9 | 50.29,19.81 57.45,19.81 60.66,16.61 64.62,16.61 64.92,16.31 64.92,15.7 66.6,14.02 67.82,14.02 79.25,2.59 80.31,2.59 R7.2 | v48.01,51.05 48.01,58.98 PICO.GP17 | v50.14,17.07 50.14,17.37 50.29,17.53 50.29,19.81
  Bottom 0.152: v48.01,34.9 v48.01,51.05 | LPGLITCH2.1 35.05,3.81 48.31,17.07 v50.14,17.07
N$1
  Top 0.152: R8.1 D3.A
N$2
  Top 0.152: D1.A 85.34,2.59 82.14,2.59 R7.1
N$3
  Top 0.152: 49.53,14.94 52.12,14.94 IRLML2502.1 | 49.53,14.94 R3.1 | 49.53,14.94 R2.2
N$4
  Top 0.152: D2.A 85.34,10.21 82.14,10.21 R6.1
N$5
  Top 0.152: 67.36,17.22 67.36,18.14 R4.1 | 67.36,17.22 67.36,14.94 R5.2 | 67.36,17.22 63.7,17.22 IRF7807PBF.4
N$6
  Top 0.152: D4.A 85.34,12.8 82.14,12.8 R9.1
N$7
  Top 0.152: D5.A 85.34,5.18 82.14,5.18 R10.1
N$8
  Top 0.152: C1.1 66.45,53.34 63.25,53.34 LDO_1.8V.4
N$9
  Top 0.152: R18.1 21.49,16.15 21.49,18.75 19.51,20.73 19.51,21.18 LVLSHFT_OUT.21
N$10
  Top 0.152: R18.2 20.57,16.15 20.57,19.05 18.9,20.73 18.9,21.18 LVLSHFT_OUT.20
N$11
  Top 0.152: R18.3 19.81,16.15 19.81,19.05 18.14,20.73 18.14,21.18 LVLSHFT_OUT.19
N$12
  Top 0.152: R18.4 19.05,16.15 19.05,19.2 17.53,20.73 17.53,21.18 LVLSHFT_OUT.18
N$13
  Top 0.152: R19.1 16.46,16.15 16.46,20.42 16.76,20.73 16.76,21.18 LVLSHFT_OUT.17
N$14
  Top 0.152: R19.2 15.7,16.15 15.7,20.42 16.15,20.88 16.15,21.18 LVLSHFT_OUT.16
N$15
  Top 0.152: R19.3 14.94,16.15 14.94,20.27 15.39,20.73 15.39,21.18 LVLSHFT_OUT.15
N$16
  Top 0.152: R19.4 14.17,16.15 14.17,20.12 14.78,20.73 14.78,21.18 LVLSHFT_OUT.14
N$17
  Top 0.152: R16.8 37.95,32.16 37.95,27.13 LVLSHFT_IN.3
N$18
  Top 0.152: R16.7 37.19,32.16 37.19,27.13 LVLSHFT_IN.4
N$19
  Top 0.152: R16.6 36.42,32.16 36.42,27.13 LVLSHFT_IN.5
N$20
  Top 0.152: R16.5 35.66,32.16 35.66,27.28 35.81,27.13 LVLSHFT_IN.6
N$21
  Top 0.152: R17.8 33.07,32.16 33.07,29.57 35.2,27.43 35.2,27.13 LVLSHFT_IN.7
N$22
  Top 0.152: R17.7 32.16,32.16 32.16,29.87 34.44,27.58 34.44,27.13 LVLSHFT_IN.8
N$23
  Top 0.152: R17.6 31.39,32.16 31.39,30.02 33.83,27.58 33.83,27.13 LVLSHFT_IN.9
N$24
  Top 0.152: R17.5 30.63,32.16 30.63,30.02 33.22,27.43 33.22,27.13 LVLSHFT_IN.10
N$26  (via drill 0.35)
  Top 0.152: JP_TRIGGER2.1 76.2,17.83 78.64,17.83 JP_TRIGGER2.2 78.79,17.83 81.23,17.83 JP_TRIGGER2.3 81.38,17.83 86.26,17.83 TRIGGER2.1 | R12.1 39.17,16.15 v39.17,17.83 39.17,18.9 37.19,20.88 37.19,21.18 LVLSHFT_IN.21 37.03,21.34 37.03,21.79 33.83,24.99 15.24,24.99 5.94,34.29 5.94,35.05 U$2.2
  Bottom 0.152: v39.17,17.83 76.2,17.83 JP_TRIGGER2.1
N$33
  Top 0.152: LVLSHFT_OUT.2 20.73,27.13 20.73,27.58 25.3,32.16 R1.1
N$34  (via drill 0.35)
  Top 0.152: v2.29,15.24 2.29,11.73 SWITCH_RST.A2 | v23.01,53.95 24.08,53.95 27.43,57.3 27.43,58.98 PICO.RUN
  Bottom 0.152: v2.29,15.24 2.29,16.61 2.13,16.76 2.13,33.07 2.9,33.83 3.81,33.83 4.57,34.59 4.57,35.51 v23.01,53.95
N$37  (via drill 0.35)
  Top 0.152: v38.41,56.24 40.23,58.06 40.23,58.98 PICO.GP19 | v27.13,13.11 17.83,3.81 GLITCH1.1
  Bottom 0.152: v38.41,56.24 25.76,56.24 25.45,56.54 24.84,56.54 24.54,56.24 24.54,30.94 32.61,22.86 38.71,22.86 39.01,22.55 39.01,21.95 30.18,13.11 v27.13,13.11
N$38
  Top 0.152: R19.5 14.02,14.48 6.1,14.48 3.35,17.22 U$2.15 | JP_RESET.1 JP_RESET.2 JP_RESET.3 RESET.1
  Bottom 0.152: U$2.15 3.35,17.22 3.35,10.21 10.97,2.59 21.18,2.59 41.45,22.86 76.66,22.86 77.57,23.77 77.57,29.41 78.64,30.48 JP_RESET.2
N$39
  Top 0.152: JP_GLITCH_EN.1 76.2,24.08 78.64,24.08 JP_GLITCH_EN.2 78.79,24.08 81.23,24.08 JP_GLITCH_EN.3 81.38,24.08 86.26,24.08 GLITCH_EN.1 | R19.6 14.78,14.33 14.78,14.02 14.48,13.72 5.18,13.72 2.13,16.76 2.13,18.75 3.2,19.81 U$2.13
  Bottom 0.152: JP_GLITCH_EN.1 76.2,24.08 41.6,24.08 30.02,12.5 12.34,12.5 6.25,18.59 4.57,18.59 3.35,19.81 U$2.13
N$40
  Top 0.152: R19.7 15.54,14.48 15.54,14.94 15.24,15.24 12.19,15.24 6.25,21.18 4.42,21.18 3.35,22.25 U$2.11
N$41  (via drill 0.35)
  Top 0.152: v17.22,15.24 16.46,14.48 R19.8 | v7.32,22.55 6.25,23.62 4.57,23.62 3.35,24.84 U$2.9
  Bottom 0.152: v17.22,15.24 14.63,15.24 v7.32,22.55
N$42
  Top 0.152: R18.5 19.05,14.33 17.53,14.33 16.61,13.41 5.03,13.41 1.83,16.61 1.83,26.06 3.2,27.43 U$2.7
N$43
  Top 0.152: R18.6 19.96,14.48 19.96,14.78 20.42,15.24 21.79,15.24 22.1,15.54 22.1,22.55 20.27,24.38 10.67,24.38 6.25,28.8 4.42,28.8 3.35,29.87 U$2.5
N$44  (via drill 0.35)
  Top 0.152: v17.83,13.72 20.27,13.72 20.57,14.02 20.57,14.33 R18.7
  Bottom 0.152: v17.83,13.72 13.72,13.72 6.25,21.18 5.33,21.18 4.57,21.95 4.57,31.24 3.35,32.46 U$2.3
N$45
  Top 0.152: 6.71,5.33 5.18,3.81 GLITCH0.1 | 6.71,5.33 13.41,12.04 19.51,12.04 21.49,14.02 21.49,14.33 R18.8 | 6.71,5.33 1.22,10.82 1.22,32.16 3.2,34.14 3.2,35.05 U$2.1
N$47
  Top 0.152: R12.2 38.41,16.15 38.41,18.9 36.58,20.73 36.58,21.18 LVLSHFT_IN.20 36.42,21.34 36.42,21.79 33.53,24.69 13.72,24.69 5.94,32.46 U$2.4
N$48  (via drill 0.35)
  Top 0.152: R12.3 37.64,16.15 37.64,19.05 35.97,20.73 35.97,21.18 LVLSHFT_IN.19 35.81,21.34 35.81,21.64 34.29,23.16 v22.4,23.16
  Bottom 0.152: v22.4,23.16 12.65,23.16 5.94,29.87 U$2.6
N$49  (via drill 0.35)
  Top 0.152: R12.4 36.88,16.15 36.88,19.2 35.36,20.73 35.36,21.18 LVLSHFT_IN.18 35.2,21.34 35.2,21.64 34.9,21.95 25.91,21.95 v25.6,21.64
  Bottom 0.152: v25.6,21.64 11.73,21.64 5.94,27.43 U$2.8
N$50  (via drill 0.35)
  Top 0.152: 34.29,20.12 34.29,20.57 34.44,20.73 34.44,21.18 LVLSHFT_IN.17 | 34.29,20.12 34.29,16.15 R13.1 | v34.44,20.12 34.29,20.12
  Bottom 0.152: v34.44,20.12 33.53,21.03 10.21,21.03 6.4,24.84 5.94,24.84 U$2.10
N$51  (via drill 0.35)
  Top 0.152: R13.2 33.53,16.15 v33.53,20.12 33.53,20.42 33.83,20.73 33.83,21.18 LVLSHFT_IN.16
  Bottom 0.152: v33.53,20.12 10.67,20.12 7.62,23.16 6.71,23.16 5.94,22.4 U$2.12
N$52  (via drill 0.35)
  Top 0.152: LVLSHFT_IN.15 33.22,21.18 33.22,20.73 32.77,20.27 32.77,16.15 R13.3 32.61,16 32.61,15.7 32.16,15.24 v24.84,15.24
  Bottom 0.152: v24.84,15.24 20.27,15.24 18.14,13.11 12.65,13.11 5.94,19.81 U$2.14
N$53
  Top 0.152: LVLSHFT_IN.14 32.61,21.18 32.61,20.73 31.85,19.96 31.85,16.15 R13.4 31.7,16 24.69,16 12.5,3.81 TRIGGER0.1
  Bottom 0.152: TRIGGER0.1 5.94,9.3 5.94,17.22 U$2.16
N$54  (via drill 0.35)
  Top 0.152: v42.82,51.36 42.82,58.98 PICO.GP18 | v48.16,33.83 48.16,11.12 51.05,8.23 51.05,7.16 48.92,5.03 25.45,5.03 24.23,3.81 TRIGGER1.1
  Bottom 0.152: v42.82,51.36 42.82,39.17 v48.16,33.83
VCC  (via drill 0.35)
  Top 0.152: C5.2 42.22,21.34 39.17,21.34 LVLSHFT_IN.24 39.01,21.18 38.56,21.18 LVLSHFT_IN.23 38.41,21.34 v38.41,22.25 | v22.71,22.25 23.47,21.49 24.54,21.49 C4.2 | v21.49,22.25 21.49,21.34 LVLSHFT_OUT.24 | TPS2041.2 61.87,37.8 62.79,37.8 TPS2041.3 62.94,37.95 62.94,38.71 v63.25,39.01 | v69.8,43.59 66.14,39.93 R11.2
  Top 0.305: C9.2 62.03,36.04 62.03,37.44 61.75,37.72 TPS2041.2 | LVLSHFT_OUT.23 20.68,21.23 21.23,21.23 LVLSHFT_OUT.24 | v16.48,57 15.09,58.4 15.09,58.95 PICO.ADC_VREF
  Bottom 0.152: v21.49,22.25 v22.71,22.25 22.71,22.55 23.62,23.47 | PINHDR_2X1.1 70.87,53.34 69.8,52.27 v69.8,43.59 65.23,39.01 v63.25,39.01 | 23.62,57 23.62,23.47 | v38.41,22.25 24.84,22.25 23.62,23.47
  Bottom 0.305: 69.57,57 23.62,57 v16.48,57 | 69.57,57 70.97,58.4 VCC_EXTERN.1 | 69.57,57 70.97,55.6 70.97,53.37 PINHDR_2X1.1
VTARGET
  Top 0.152: 74.98,38.56 74.98,17.22 79.4,12.8 80.31,12.8 R9.2
  Top 0.305: C7.1 57.84,41.91 58.67,41.91 60.07,43.31 TPS2041.8 60.35,43.59 61.47,43.59 TPS2041.7 61.75,43.59 62.87,43.59 TPS2041.6 62.87,41.07 65.38,38.56 70.69,38.56 C8.+ 70.97,38.56 74.98,38.56 75.72,38.56 76,38.28 JP_VTARGET.1 76.28,38 78.51,38 JP_VTARGET.2 78.79,38 81.03,38 JP_VTARGET.3 VTARGET.1
VTARGET_EN
  Top 0.152: TPS2041.4 64.01,37.95 64.01,39.17 62.18,41 52.58,41 42.82,50.75 42.52,50.75 37.8,55.47 37.8,58.98 PICO.GP20
VTARGET_OC
  Top 0.152: R11.1 65.99,41.6 64.16,43.43 TPS2041.5 64.01,43.59 59.28,48.31 49.23,48.31 43.89,53.65 43.89,60.2 43.13,60.96 37.03,60.96 35.2,59.13 PICO.GP21

### Text on the board
tNames: VCC_INTERN | 1V8 | 3V3 | 5V | Raspberry Pi Pico | 7 | 15 | Pico Glitcher v1 / (c) 2024 Matthias Kesenheimer | 0 | 8 | VTARGET | GLITCH_EN | TRIGGER | HPGLITCH | LPGLITCH | GLITCH0